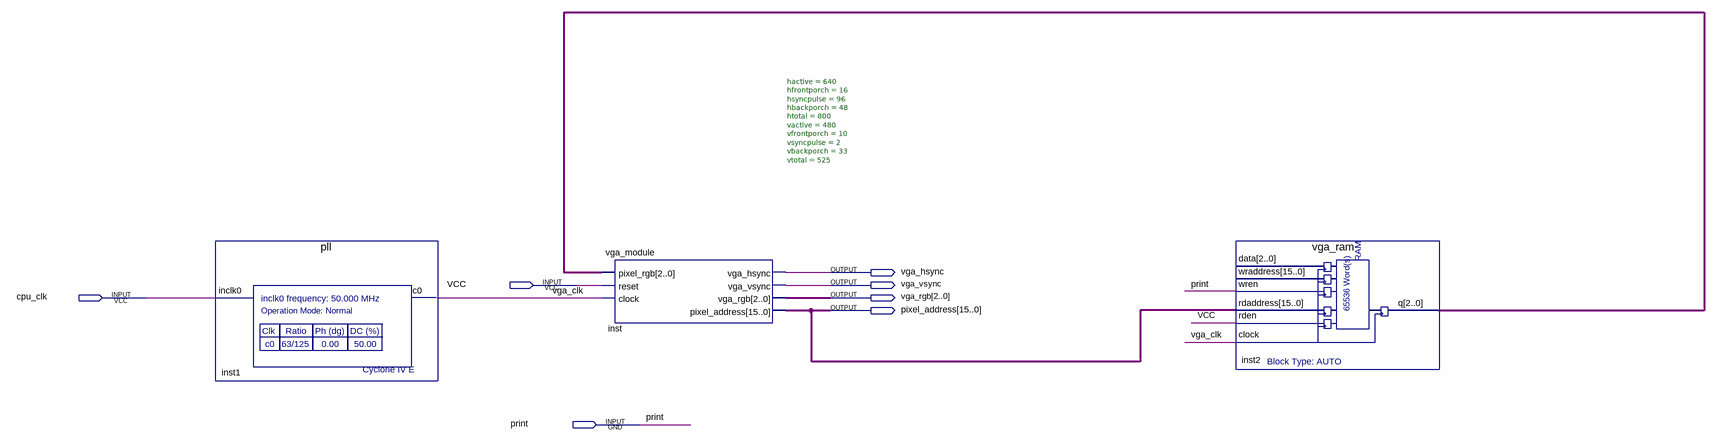
[diagram p0: schematic sheet]
// Quartus schematic vga.bdf as structural Verilog: 3 symbols, 7 pins
module vga (
  input  VCC,
  input  cpu_clk,
  input  print,
  output vga_hsync,
  output vga_vsync,
  output [2:0] vga_rgb,
  output [15:0] pixel_address
);

  wire vga_clk;
  wire [2:0] inst2_q;

  pll inst1 (.inclk0(cpu_clk), .c0(vga_clk));
  vga_module #(.hactive(640), .hfrontporch(16), .hsyncpulse(96), .hbackporch(48), .htotal(800), .vactive(480), .vfrontporch(10), .vsyncpulse(2), .vbackporch(33), .vtotal(525)) inst (
    .pixel_rgb(inst2_q), .reset(VCC), .clock(vga_clk), .vga_hsync(vga_hsync), .vga_vsync(vga_vsync),
    .vga_rgb(vga_rgb), .pixel_address(pixel_address));
  vga_ram inst2 (
    .wren(print), .rdaddress(pixel_address), .rden(VCC), .clock(vga_clk), .q(inst2_q));  // open: data, wraddress
endmodule
